# EAGLE design OUT_7SEG (EAGLE 9.6.2)
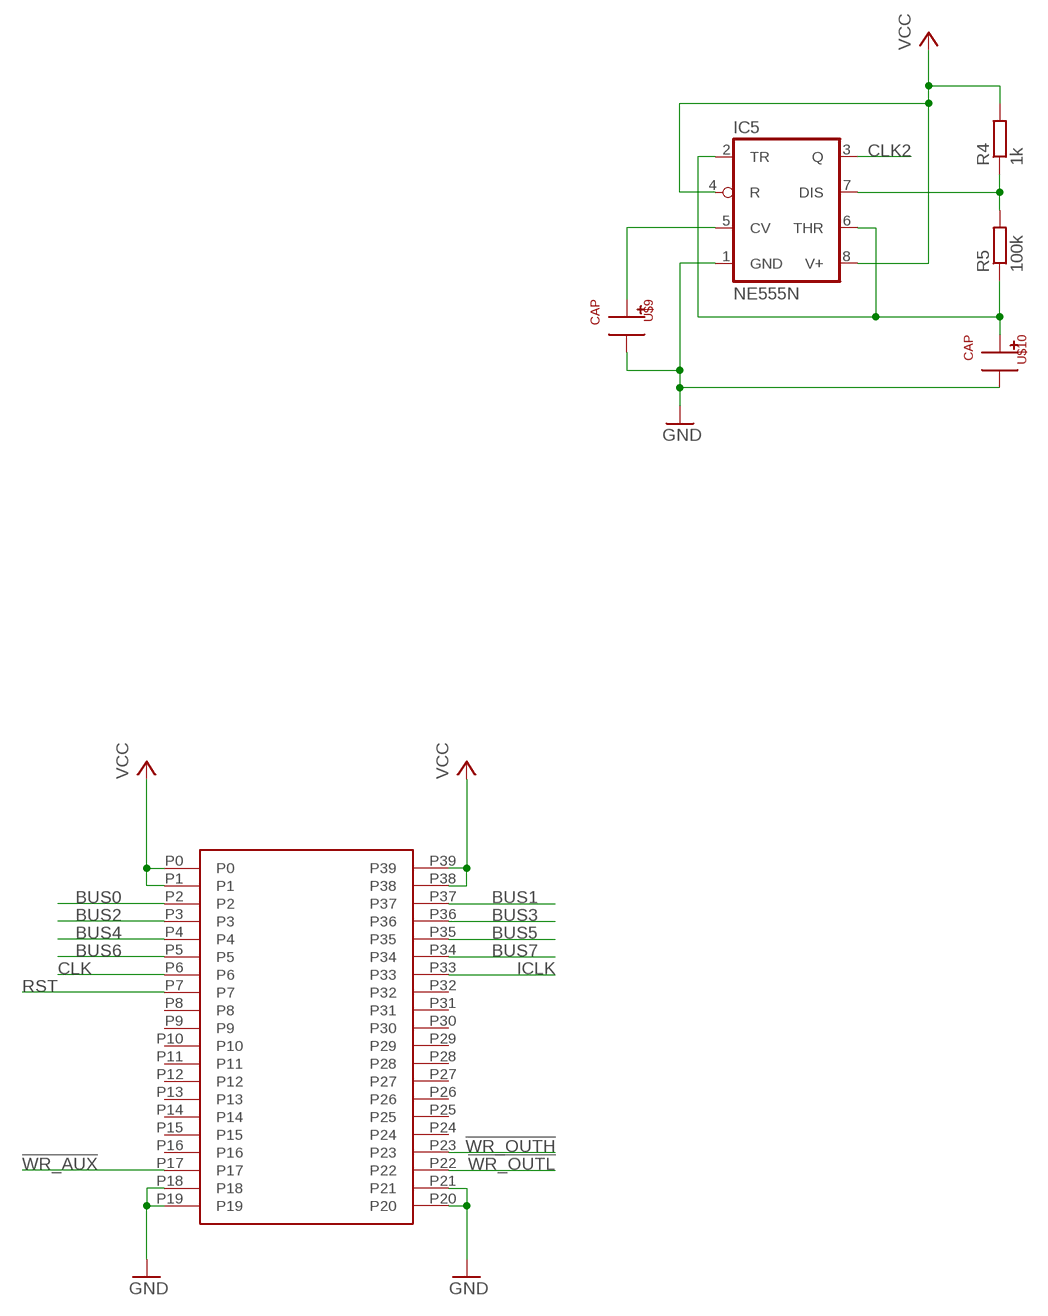
[diagram p0: schematic, sheet 1, part 1 of 2]
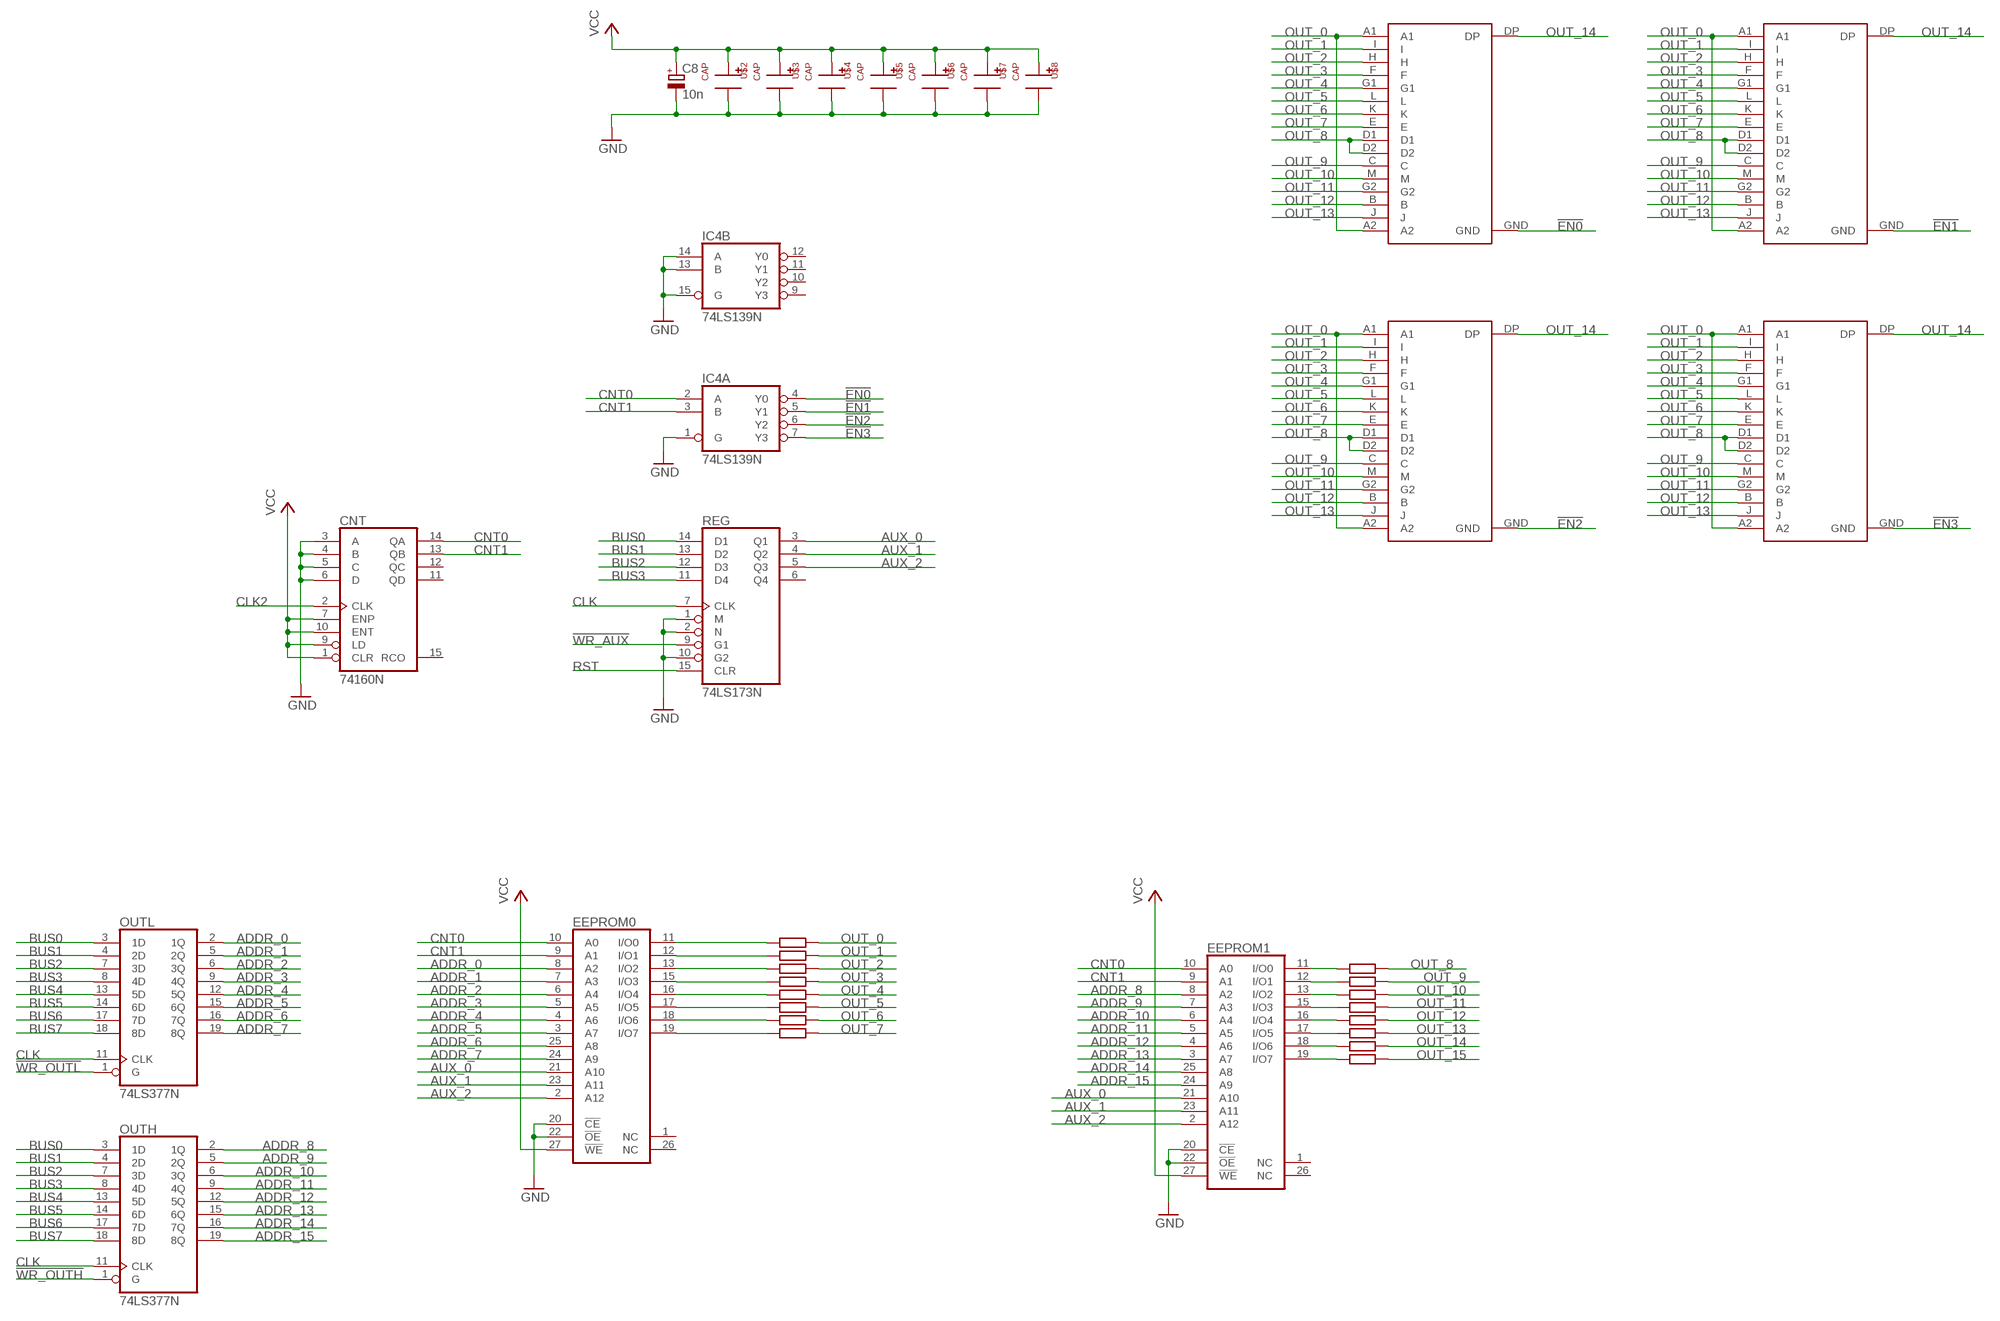
[diagram p1: schematic, sheet 1, part 2 of 2]

## Parts
C8  10n  CPOL-EUE2,5-6E  [E2,5-6E]
CNT  74160N  [DIL16]
DISP1  16SEG  [16SEG]
DISP2  16SEG  [16SEG]
DISP3  16SEG  [16SEG]
DISP4  16SEG  [16SEG]
EEPROM0  78C64P  [DIL28-6]
EEPROM1  78C64P  [DIL28-6]
IC4  74LS139N  [DIL16]
IC5  NE555N  [DIL08]
OUTH  74LS377N  [DIL20]
OUTL  74LS377N  [DIL20]
R1  330  R-EU_R0805  [R0805]
R2  330  R-EU_R0805  [R0805]
R3  330  R-EU_R0805  [R0805]
R4  1k  R-EU_0204/7  [0204/7]
R5  100k  R-EU_0204/7  [0204/7]
R6  330  R-EU_R0805  [R0805]
R7  330  R-EU_R0805  [R0805]
R8  330  R-EU_R0805  [R0805]
R9  330  R-EU_R0805  [R0805]
R10  330  R-EU_R0805  [R0805]
R11  330  R-EU_R0805  [R0805]
R12  330  R-EU_R0805  [R0805]
R13  330  R-EU_R0805  [R0805]
R14  330  R-EU_R0805  [R0805]
R15  330  R-EU_R0805  [R0805]
R16  330  R-EU_R0805  [R0805]
R17  330  R-EU_R0805  [R0805]
R41  330  R-EU_R0805  [R0805]
REG  74LS173N  [DIL16]
U$1  2X40  [2X40]
U$2  CAP  [CAP]
U$3  CAP  [CAP]
U$4  CAP  [CAP]
U$5  CAP  [CAP]
U$6  CAP  [CAP]
U$7  CAP  [CAP]
U$8  CAP  [CAP]
U$9  CAP  [CAP]
U$10  CAP  [CAP]

## Nets
!EN0: DISP1.GND IC4.4(A:Y0)
!EN1: DISP2.GND IC4.5(A:Y1)
!EN2: DISP3.GND IC4.6(A:Y2)
!EN3: DISP4.GND IC4.7(A:Y3)
!WR_AUX: REG.9(G1) U$1.P17
!WR_OUTH: OUTH.1(G) U$1.P23
!WR_OUTL: OUTL.1(G) U$1.P22
ADDR_0: EEPROM0.8(A2) OUTL.2(1Q)
ADDR_1: EEPROM0.7(A3) OUTL.5(2Q)
ADDR_2: EEPROM0.6(A4) OUTL.6(3Q)
ADDR_3: EEPROM0.5(A5) OUTL.9(4Q)
ADDR_4: EEPROM0.4(A6) OUTL.12(5Q)
ADDR_5: EEPROM0.3(A7) OUTL.15(6Q)
ADDR_6: EEPROM0.25(A8) OUTL.16(7Q)
ADDR_7: EEPROM0.24(A9) OUTL.19(8Q)
ADDR_8: EEPROM1.8(A2) OUTH.2(1Q)
ADDR_9: EEPROM1.7(A3) OUTH.5(2Q)
ADDR_10: EEPROM1.6(A4) OUTH.6(3Q)
ADDR_11: EEPROM1.5(A5) OUTH.9(4Q)
ADDR_12: EEPROM1.4(A6) OUTH.12(5Q)
ADDR_13: EEPROM1.3(A7) OUTH.15(6Q)
ADDR_14: EEPROM1.25(A8) OUTH.16(7Q)
ADDR_15: EEPROM1.24(A9) OUTH.19(8Q)
AUX_0: EEPROM0.21(A10) EEPROM1.21(A10) REG.3(Q1)
AUX_1: EEPROM0.23(A11) EEPROM1.23(A11) REG.4(Q2)
AUX_2: EEPROM0.2(A12) EEPROM1.2(A12) REG.5(Q3)
BUS0: OUTH.3(1D) OUTL.3(1D) REG.14(D1) U$1.P2
BUS1: OUTH.4(2D) OUTL.4(2D) REG.13(D2) U$1.P37
BUS2: OUTH.7(3D) OUTL.7(3D) REG.12(D3) U$1.P3
BUS3: OUTH.8(4D) OUTL.8(4D) REG.11(D4) U$1.P36
BUS4: OUTH.13(5D) OUTL.13(5D) U$1.P4
BUS5: OUTH.14(6D) OUTL.14(6D) U$1.P35
BUS6: OUTH.17(7D) OUTL.17(7D) U$1.P5
BUS7: OUTH.18(8D) OUTL.18(8D) U$1.P34
CLK: OUTH.11(CLK) OUTL.11(CLK) REG.7(CLK) U$1.P6
CLK2: CNT.2(CLK) IC5.3(Q)
CNT0: CNT.14(QA) EEPROM0.10(A0) EEPROM1.10(A0) IC4.2(A:A)
CNT1: CNT.13(QB) EEPROM0.9(A1) EEPROM1.9(A1) IC4.3(A:B)
GND [supply]: C8.- CNT.3(A) CNT.4(B) CNT.5(C) CNT.6(D) EEPROM0.20(!CE) EEPROM0.22(!OE) EEPROM1.20(!CE) EEPROM1.22(!OE) IC4.1(A:G) IC4.13(B:B) IC4.14(B:A) IC4.15(B:G) IC5.1(GND) REG.1(M) REG.2(N) REG.10(G2) U$1.P18 U$1.P19 U$1.P20 U$1.P21 U$2.P- U$3.P- U$4.P- U$5.P- U$6.P- U$7.P- U$8.P- U$9.P- U$10.P-
ICLK: U$1.P33
N$1: IC5.7(DIS) R4.1 R5.2
N$2: IC5.5(CV) U$9.P+
N$3: EEPROM1.11(I/O0) R41.1
N$4: EEPROM1.12(I/O1) R1.1
N$5: EEPROM1.13(I/O2) R2.1
N$6: EEPROM1.15(I/O3) R3.1
N$7: EEPROM1.16(I/O4) R6.1
N$8: EEPROM1.17(I/O5) R7.1
N$9: EEPROM1.18(I/O6) R8.1
N$10: EEPROM1.19(I/O7) R9.1
N$11: EEPROM0.11(I/O0) R10.1
N$12: EEPROM0.12(I/O1) R11.1
N$13: EEPROM0.13(I/O2) R12.1
N$14: EEPROM0.15(I/O3) R13.1
N$15: EEPROM0.16(I/O4) R14.1
N$16: EEPROM0.17(I/O5) R16.1
N$17: EEPROM0.18(I/O6) R15.1
N$18: EEPROM0.19(I/O7) R17.1
N$36: IC5.2(TR) IC5.6(THR) R5.1 U$10.P+
OUT_0: DISP1.A1 DISP1.A2 DISP2.A1 DISP2.A2 DISP3.A1 DISP3.A2 DISP4.A1 DISP4.A2 R10.2
OUT_1: DISP1.I DISP2.I DISP3.I DISP4.I R11.2
OUT_2: DISP1.H DISP2.H DISP3.H DISP4.H R12.2
OUT_3: DISP1.F DISP2.F DISP3.F DISP4.F R13.2
OUT_4: DISP1.G1 DISP2.G1 DISP3.G1 DISP4.G1 R14.2
OUT_5: DISP1.L DISP2.L DISP3.L DISP4.L R16.2
OUT_6: DISP1.K DISP2.K DISP3.K DISP4.K R15.2
OUT_7: DISP1.E DISP2.E DISP3.E DISP4.E R17.2
OUT_8: DISP1.D1 DISP1.D2 DISP2.D1 DISP2.D2 DISP3.D1 DISP3.D2 DISP4.D1 DISP4.D2 R41.2
OUT_9: DISP1.C DISP2.C DISP3.C DISP4.C R1.2
OUT_10: DISP1.M DISP2.M DISP3.M DISP4.M R2.2
OUT_11: DISP1.G2 DISP2.G2 DISP3.G2 DISP4.G2 R3.2
OUT_12: DISP1.B DISP2.B DISP3.B DISP4.B R6.2
OUT_13: DISP1.J DISP2.J DISP3.J DISP4.J R7.2
OUT_14: DISP1.DP DISP2.DP DISP3.DP DISP4.DP R8.2
OUT_15: R9.2
RST: REG.15(CLR) U$1.P7
VCC [supply]: C8.+ CNT.1(CLR) CNT.7(ENP) CNT.9(LD) CNT.10(ENT) EEPROM0.27(!WE) EEPROM1.27(!WE) IC5.4(R) IC5.8(V+) R4.2 U$1.P0 U$1.P1 U$1.P38 U$1.P39 U$2.P+ U$3.P+ U$4.P+ U$5.P+ U$6.P+ U$7.P+ U$8.P+
Unconnected: CNT.11(QD) CNT.12(QC) CNT.15(RCO) EEPROM0.1(NC) EEPROM0.26(NC) EEPROM1.1(NC) EEPROM1.26(NC) IC4.9(B:Y3) IC4.10(B:Y2) IC4.11(B:Y1) IC4.12(B:Y0) REG.6(Q4) U$1.P8 U$1.P9 U$1.P10 U$1.P11 U$1.P12 U$1.P13 U$1.P14 U$1.P15 U$1.P16 U$1.P24 U$1.P25 U$1.P26 U$1.P27 U$1.P28 U$1.P29 U$1.P30 U$1.P31 U$1.P32

## Power pins joined to a net without a drawn wire
GND: CNT.8(GND) EEPROM0.14(GND) EEPROM1.14(GND) IC4.8(P:GND) OUTH.10(GND) OUTL.10(GND) REG.8(GND)
VCC: CNT.16(VCC) EEPROM0.28(VCC) EEPROM1.28(VCC) IC4.16(P:VCC) OUTH.20(VCC) OUTL.20(VCC) REG.16(VCC)

## Library data of the parts
C8 = rcl:CPOL-EU: POLARIZED CAPACITOR, European symbol; SPICEPREFIX: C
CNT = 74xx-eu:74*160: Synchronous 4-bit COUNTER
DISP1-DISP4 = IsaacAlonso:16SEG
EEPROM0 EEPROM1 = memory-idt:78C64P: MEMORY; OC_FARNELL: unknown; OC_NEWARK: unknown
IC4 = 74xx-eu:74*139: Dual 2-line to 4-line DECODER/DEMULTIPLEXER
IC5 = linear:*555: TIMER
OUTH OUTL = 74xx-eu:74*377: Octal D type FLIP FLOP, enable
R1-R17 R41 = rcl:R-EU_: RESISTOR, European symbol; SPICEPREFIX: R
REG = 74xx-eu:74*173: 4-bit D type REGISTER, 3-state
U$1 = IsaacAlonso:2X40
U$2-U$10 = IsaacAlonso:CAP

## Net classes
1 supply: width 0.508 mm

## Board
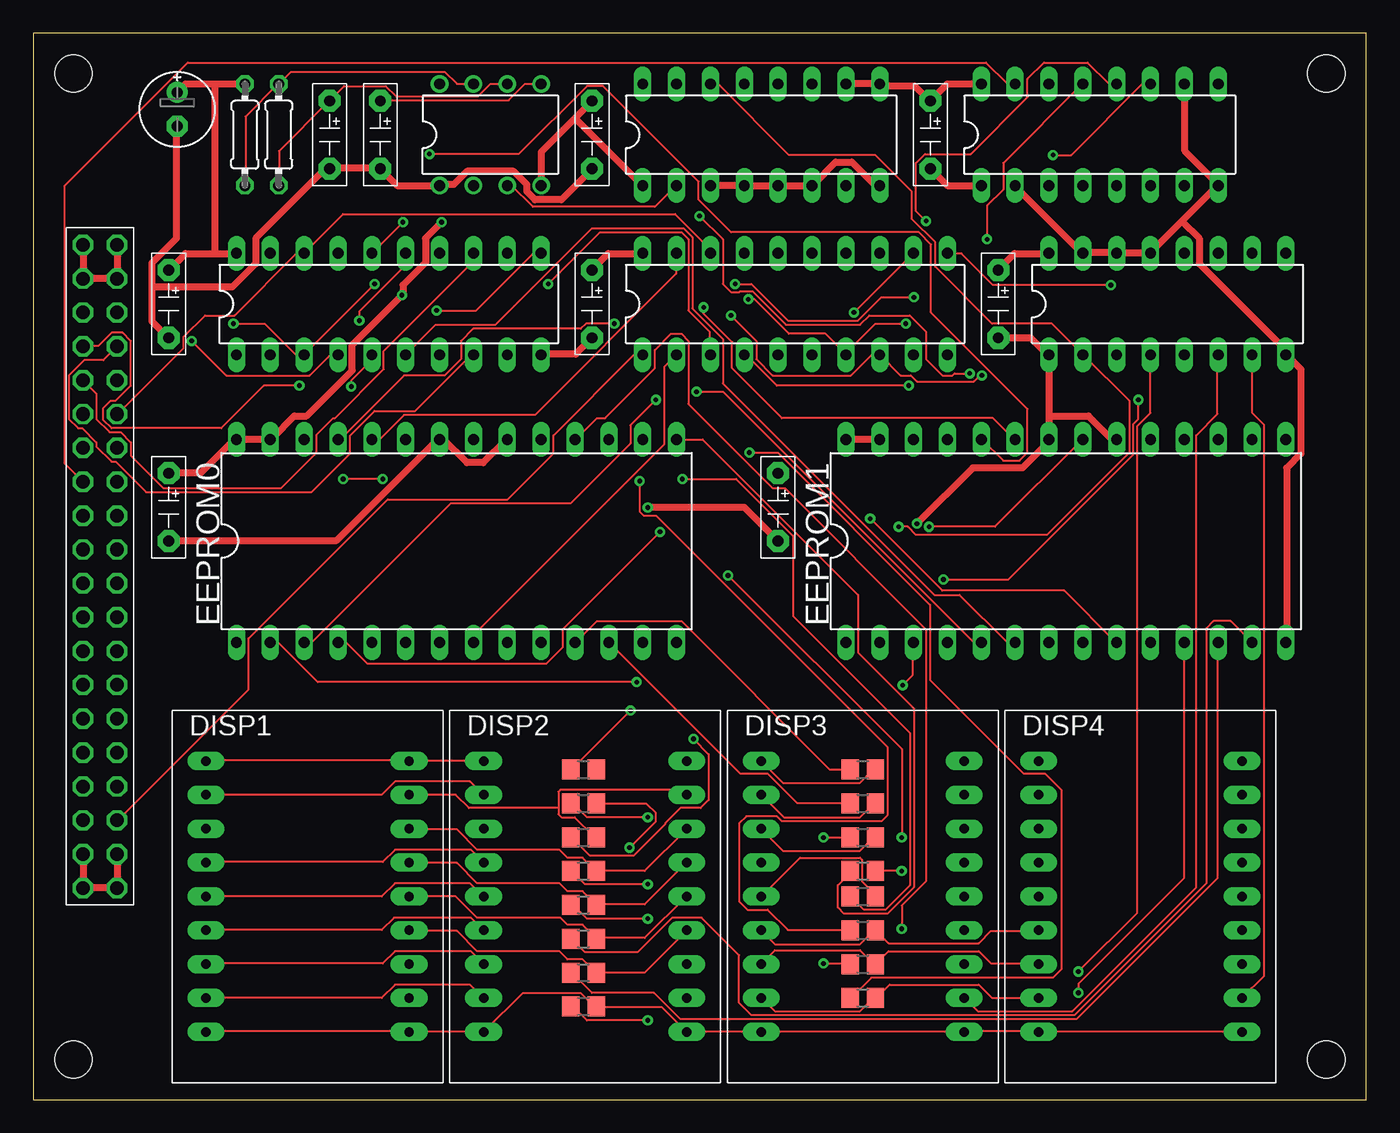
[diagram p2: board, top side]
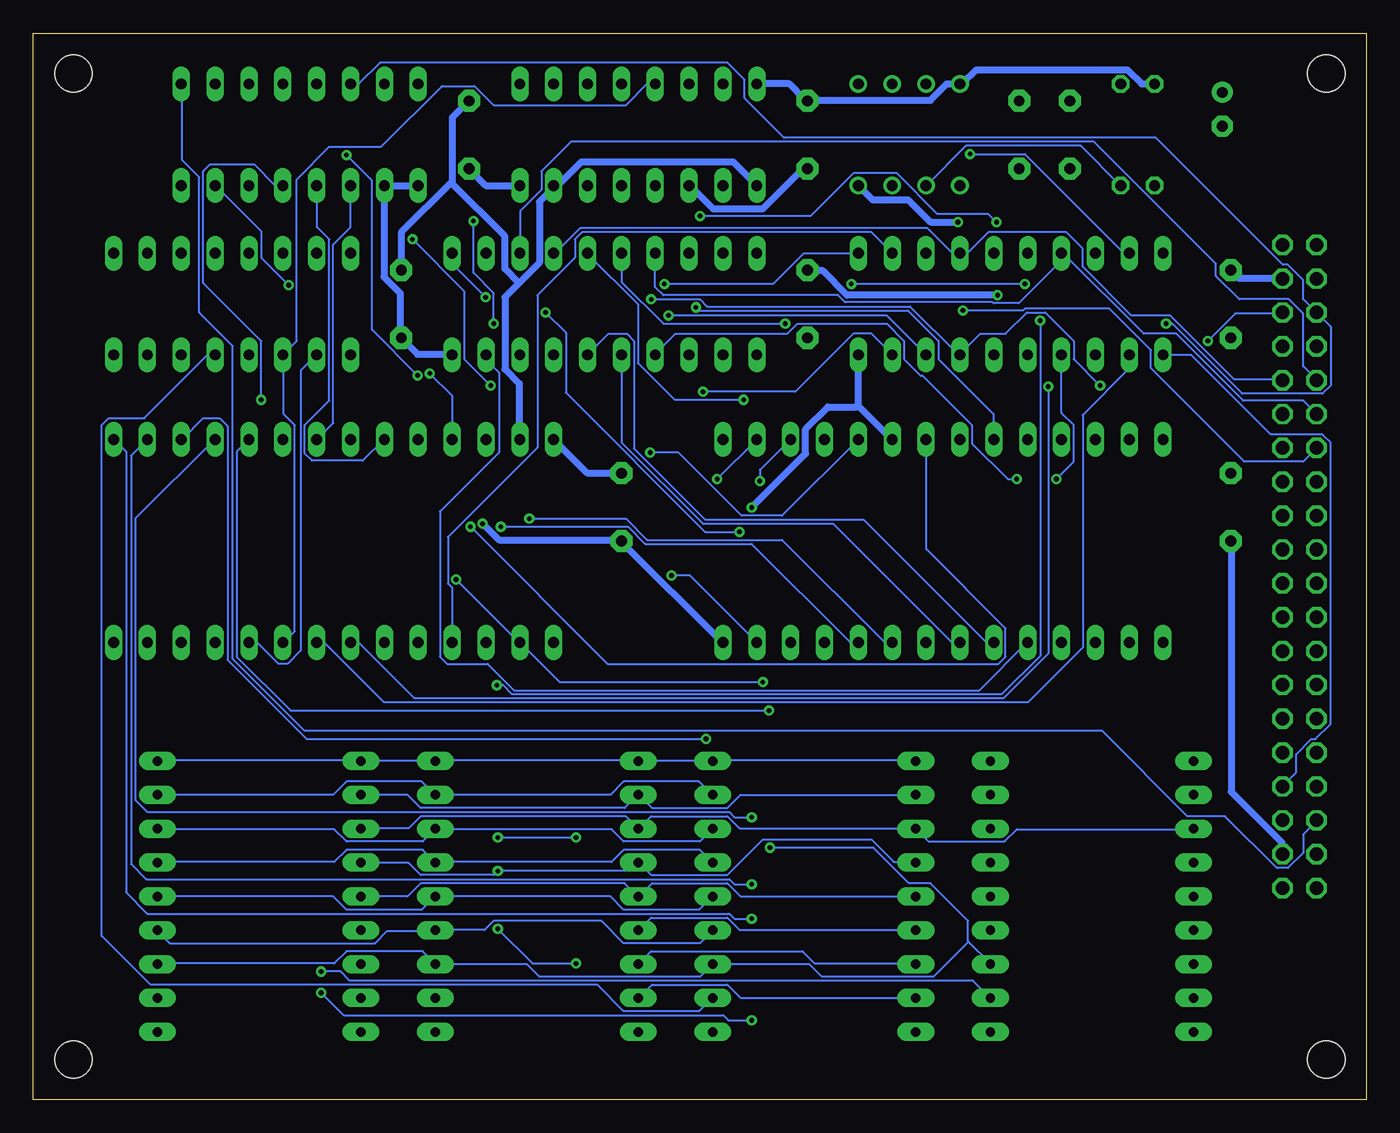
[diagram p3: board, bottom side, seen from below]

Size 100 x 80 mm. Coordinates in mm from the lower left corner, seen from the top.
Outline: 0,0 100,0 100,80 0,80 0,0
Copper layers (1*16): Top 0.035mm / dielectric 1.5mm / Bottom 0.035mm
Design rules "default": minimum track width 6mil, minimum drill 0.35mm, track to track 6mil, track to pad 6mil, pad to pad 6mil, via to via 6mil, smd to smd 6mil, copper to edge 40mil, drill to drill 6mil, minimum pad ring 10mil, minimum via ring 8mil, stop-mask expansion 4mil, vias tented up to drill 0mil, thermal gap 10mil
Holes 2.8 mm at 3,77 3,3 97,3 97,77
vRestrict: area 59.2,47 to 95.8,52.1; area 59.2,31.8 to 95.8,36.8; area 13.5,31.8 to 50,36.8; area 13.5,47 to 50,52.1; area 14,61.6 to 39.4,65.4; area 14,54 to 39.4,57.8; area 44.5,61.6 to 67.3,65.4; area 44.5,54 to 69.8,57.8; area 74.9,61.6 to 95.2,65.4; area 74.9,54 to 95.2,57.8; area 69.8,66.7 to 90.2,70.5; area 69.8,74.3 to 90.2,78.1; 9 more areas

### Footprints (pad centres in the part's own frame; a part is rotated, then mirrored left to right if it is on the bottom)
E2,5-6E = drill 0.813 pad 1.575: + -1.27,0 | drill 0.813 pad 1.575 octagon: - 1.27,0
DIL16 = drill 0.813 long: 1 -8.89,-3.81; 2 -6.35,-3.81; 3 -3.81,-3.81; 4 -1.27,-3.81; 5 1.27,-3.81; 6 3.81,-3.81; 7 6.35,-3.81; 8 8.89,-3.81; 9 8.89,3.81; 10 6.35,3.81; 11 3.81,3.81; 12 1.27,3.81; 13 -1.27,3.81; 14 -3.81,3.81; 15 -6.35,3.81; 16 -8.89,3.81
16SEG = drill 0.711 pad 1.397 long: A1 -7.62,10.16; A2 7.62,10.16; B 7.62,5.08; C 7.62,-2.54; D1 -7.62,-10.16; D2 7.62,-10.16; DP 7.62,-5.08; E -7.62,-7.62; F -7.62,2.54; G1 -7.62,0; G2 7.62,2.54; GND 7.62,-7.62; H -7.62,5.08; I -7.62,7.62; J 7.62,7.62; K -7.62,-5.08; L -7.62,-2.54; M 7.62,0
DIL28-6 = drill 0.813 long: 1 -16.51,-7.62; 2 -13.97,-7.62; 3 -11.43,-7.62; 4 -8.89,-7.62; 5 -6.35,-7.62; 6 -3.81,-7.62; 7 -1.27,-7.62; 8 1.27,-7.62; 9 3.81,-7.62; 10 6.35,-7.62; 11 8.89,-7.62; 12 11.43,-7.62; 13 13.97,-7.62; 14 16.51,-7.62; 15 16.51,7.62; 16 13.97,7.62; 17 11.43,7.62; 18 8.89,7.62; 19 6.35,7.62; 20 3.81,7.62; 21 1.27,7.62; 22 -1.27,7.62; 23 -3.81,7.62; 24 -6.35,7.62; 25 -8.89,7.62; 26 -11.43,7.62; 27 -13.97,7.62; 28 -16.51,7.62
DIL08 = drill 0.813 pad 1.27: 1 -3.81,-3.81; 2 -1.27,-3.81; 3 1.27,-3.81; 4 3.81,-3.81; 5 3.81,3.81; 6 1.27,3.81; 7 -1.27,3.81; 8 -3.81,3.81
DIL20 = drill 0.813 long: 1 -11.43,-3.81; 2 -8.89,-3.81; 3 -6.35,-3.81; 4 -3.81,-3.81; 5 -1.27,-3.81; 6 1.27,-3.81; 7 3.81,-3.81; 8 6.35,-3.81; 9 8.89,-3.81; 10 11.43,-3.81; 11 11.43,3.81; 12 8.89,3.81; 13 6.35,3.81; 14 3.81,3.81; 15 1.27,3.81; 16 -1.27,3.81; 17 -3.81,3.81; 18 -6.35,3.81; 19 -8.89,3.81; 20 -11.43,3.81
R0805 = smd 1.3 x 1.5: 1 -0.95,0; 2 0.95,0
0204/7 = drill 0.813 octagon: 1 -3.81,0; 2 3.81,0
2X40 = drill 1.016 octagon: P0 -1.27,24.13; P1 -1.27,21.59; P2 -1.27,19.05; P3 -1.27,16.51; P4 -1.27,13.97; P5 -1.27,11.43; P6 -1.27,8.89; P7 -1.27,6.35; P8 -1.27,3.81; P9 -1.27,1.27; P10 -1.27,-1.27; P11 -1.27,-3.81; P12 -1.27,-6.35; P13 -1.27,-8.89; P14 -1.27,-11.43; P15 -1.27,-13.97; P16 -1.27,-16.51; P17 -1.27,-19.05; P18 -1.27,-21.59; P19 -1.27,-24.13; P20 1.27,-24.13; P21 1.27,-21.59; P22 1.27,-19.05; P23 1.27,-16.51; P24 1.27,-13.97; P25 1.27,-11.43; P26 1.27,-8.89; P27 1.27,-6.35; P28 1.27,-3.81; P29 1.27,-1.27; P30 1.27,1.27; P31 1.27,3.81; P32 1.27,6.35; P33 1.27,8.89; P34 1.27,11.43; P35 1.27,13.97; P36 1.27,16.51; P37 1.27,19.05; P38 1.27,21.59; P39 1.27,24.13
CAP = drill 0.813 pad 1.651 octagon: P+ 0,2.54; P- 0,-2.54

### Placement (x,y rotation side)
C8  10.79,74.3 270 top
CNT  54.61,72.39 0 top
DISP1  20.57,15.24 0 top
DISP2  41.4,15.24 0 top
DISP3  62.23,15.24 0 top
DISP4  83.06,15.24 0 top
EEPROM0  31.75,41.91 0 top
EEPROM1  77.47,41.91 0 top
IC4  85.09,59.69 0 top
IC5  34.29,72.39 0 top
OUTH  26.67,59.69 0 top
OUTL  57.15,59.69 0 top
R1  41.27,9.53 0 top
R2  41.27,12.06 0 top
R3  41.27,14.61 0 top
R4  15.88,72.39 90 top
R5  18.41,72.39 90 top
R6  41.27,17.14 0 top
R7  41.27,19.68 0 top
R8  41.27,22.23 0 top
R9  41.27,24.77 0 top
R10  62.23,24.77 0 top
R11  62.23,22.23 0 top
R12  62.23,19.68 0 top
R13  62.23,17.14 0 top
R14  62.23,15.24 0 top
R15  62.23,10.16 0 top
R16  62.23,12.7 0 top
R17  62.23,7.62 0 top
R41  41.27,6.99 0 top
REG  80.01,72.39 0 top
U$1  5,40 0 top
U$2  72.39,59.69 0 top
U$3  41.91,59.69 0 top
U$4  55.88,44.45 0 top
U$5  10.16,59.69 0 top
U$6  10.16,44.45 0 top
U$7  41.91,72.39 0 top
U$8  67.31,72.39 0 top
U$9  26.04,72.39 0 top
U$10  22.23,72.39 0 top

### Tracks (layer width: path | path; a pad name or v marks a point on that pad's centre or on a via)
!EN0  (via drill 0.35)
  Top 0.152: IC4.4 83.82,51.51 82.83,50.52 82.83,14.02 v78.41,9.6
  Bottom 0.152: v78.41,9.6 76.96,9.6 76.28,8.91 29.49,8.91 DISP1.GND
!EN1
  Bottom 0.152: IC4.5 86.41,55.85 86.94,55.85 91.67,51.13 94.34,51.13 94.87,50.6 94.87,12.27 91.21,8.61 57.68,8.61 55.7,6.63 50.06,6.63 49.07,7.62 DISP2.GND
!EN2
  Top 0.152: IC4.6 88.85,55.85 88.85,51.44 87.25,49.84 87.25,15.93 77.95,6.63 70.87,6.63 69.88,7.62 DISP3.GND
!EN3
  Top 0.152: IC4.7 91.44,51.51 92.35,50.6 92.35,9.3 DISP4.GND
!WR_AUX
  Bottom 0.152: REG.9 88.85,76.2 88.85,70.48 87.55,69.19 87.55,59.05 85.04,56.54 85.04,33.07 79.63,27.66 19.81,27.66 13.41,21.26 10.59,21.26 6.71,17.37 5.87,17.37 4.72,18.52 4.72,19.89 3.73,20.88 U$1.P17
!WR_OUTH
  Bottom 0.152: OUTH.1 15.24,55.85 13.11,55.85 7.16,49.91 3.28,49.91 2.67,49.3 2.67,28.19 3.81,27.05 4.12,27.05 5.26,25.91 5.26,24.54 6.25,23.55 U$1.P23
!WR_OUTL
  Top 0.152: OUTL.1 45.72,55.85 45.03,55.85 39.01,49.84 39.01,48.46 35.59,45.03 26.59,45.03 16.15,34.59 16.15,30.79 6.33,20.95 U$1.P22
ADDR_0
  Top 0.152: OUTL.2 47.32,54.94 47.32,49.15 33.07,34.9 33.07,34.29 EEPROM0.8
ADDR_1
  Bottom 0.152: EEPROM0.7 31.09,34.29 40.01,43.2 49.76,43.2 55.85,49.3 55.85,55.85 OUTL.5
ADDR_2
  Bottom 0.152: EEPROM0.6 28.5,34.29 37.72,43.51 49.61,43.51 54.94,48.84 54.94,56.92 55.47,57.45 56.84,57.45 OUTL.6
ADDR_3
  Bottom 0.152: EEPROM0.5 25.45,34.29 29.03,30.71 63.93,30.71 65.91,32.69 68.96,32.69 69.49,33.22 69.49,44.12 65.08,48.54 65.08,54.56 65.99,55.47 65.99,55.85 OUTL.9
ADDR_4  (via drill 0.35)
  Top 0.152: EEPROM0.4 23.47,34.29 25.07,32.69 38.48,32.69 39.7,33.91 39.7,35.28 v47.02,42.6 | v61.57,59.05 65.99,63.48 OUTL.12
  Bottom 0.152: v47.02,42.6 49.61,42.6 60.05,53.03 60.05,57.53 v61.57,59.05
ADDR_5  (via drill 0.35)
  Top 0.152: EEPROM0.3 20.88,34.29 31.32,44.73 40.31,44.73 44.81,49.23 44.81,50.6 v46.71,52.5
  Bottom 0.152: v46.71,52.5 51.89,52.5 54.63,55.24 54.63,59.66 58.45,63.48 OUTL.15
ADDR_6  (via drill 0.35)
  Top 0.152: EEPROM0.25 23.01,49.53 27.81,54.33 30.86,54.33 32.08,55.55 32.08,56.92 32.99,57.84 41.07,57.84 41.45,58.22 v43.59,58.22
  Bottom 0.152: v43.59,58.22 52.73,58.22 55.85,61.34 55.85,63.48 OUTL.16
ADDR_7
  Top 0.152: EEPROM0.24 25.98,49.53 27.81,51.36 37.64,51.36 48.23,61.95 48.23,63.48 OUTL.19
ADDR_8
  Bottom 0.152: EEPROM1.8 78.18,34.29 73.69,29.79 25.38,29.79 21.26,33.91 21.26,51.36 17.83,54.79 17.83,55.85 OUTH.2
ADDR_9  (via drill 0.35)
  Top 0.152: v23.85,53.49 23.85,53.95 25.38,55.47 25.38,55.85 OUTH.5
  Bottom 0.152: EEPROM1.7 75.59,34.29 71.4,30.1 27.2,30.1 23.85,33.45 v23.85,53.49
ADDR_10
  Top 0.152: EEPROM1.6 73.08,34.29 69.49,37.87 67.59,37.87 51.74,53.72 51.74,57.07 49.45,59.36 49.45,64.69 48.77,65.38 41.91,65.38 34.67,58.14 30.18,58.14 27.96,55.93 OUTH.6
ADDR_11  (via drill 0.35)
  Top 0.152: EEPROM1.5 70.56,34.29 51.74,53.11 v49.76,53.11
  Bottom 0.152: v49.76,53.11 42.82,53.11 38.48,57.45 37.11,57.45 35.59,55.93 OUTH.9
ADDR_12
  Bottom 0.152: EEPROM1.4 68.58,38.41 68.89,38.71 68.89,42.22 62.18,48.92 62.18,60.35 59.36,63.17 59.36,64.54 58.83,65.08 37.11,65.08 35.59,63.55 OUTH.12
ADDR_13  (via drill 0.35)
  Top 0.152: v65.23,31.09 65.99,31.85 65.99,34.29 EEPROM1.3 | v24.46,58.45 24.46,59.13 27.89,62.56 27.89,63.48 OUTH.15
  Bottom 0.152: v65.23,31.09 64.77,31.09 64.08,30.4 27.36,30.4 24.46,33.3 v24.46,58.45
ADDR_14  (via drill 0.35)
  Top 0.152: v70.26,54.48 69.11,54.48 68.96,54.33 68.2,54.33 66.98,55.55 66.98,57.61 65.76,58.83 62.71,58.83 62.03,58.14 56.46,58.14 53.95,60.66 53.03,60.66 52.96,60.58 52.35,60.58 51.74,61.19 51.74,64.54 v49.99,66.29 | OUTH.16 v27.74,65.84
  Bottom 0.152: EEPROM1.25 68.58,52.81 v70.26,54.48 | v49.99,66.29 41.68,66.29 38.48,69.49 35.2,69.49 32.16,66.45 28.35,66.45 v27.74,65.84
ADDR_15  (via drill 0.35)
  Top 0.152: v29.72,70.94 36.42,70.94 41.53,76.05 42.75,76.05 49.91,68.89 49.91,67.51 52.35,65.08 66.45,65.08 67.36,64.16 67.36,59.05 74.6,51.82 74.6,48.54 73.99,47.93 72.77,47.93 71.17,49.53 EEPROM1.24
  Bottom 0.152: v29.72,70.94 25.6,70.94 18.21,63.55 17.83,63.55 OUTH.19
AUX_0  (via drill 0.35)
  Top 0.152: v67.21,42.98 72.16,42.98 78.72,49.53 EEPROM1.21
  Bottom 0.152: v67.21,42.98 56.92,32.69 27.58,32.69 27.05,33.22 27.05,35.36 32.99,41.3 32.99,49.53 EEPROM0.21 | REG.3 76.2,65.46 77.5,64.16 77.5,50.75 78.72,49.53 EEPROM1.21
AUX_1  (via drill 0.35)
  Top 0.152: v50.29,59.44 50.29,58.98 52.43,56.84 52.43,54.86 56.16,51.13 72.01,51.13 73.61,49.53 EEPROM1.23
  Bottom 0.152: v50.29,59.44 50.06,59.21 34.37,59.21 32.08,56.92 32.08,55.55 27.96,51.44 27.96,49.53 EEPROM0.23 | REG.4 78.72,68.58 78.72,65.46 77.8,64.54 77.8,52.43 79.63,50.6 79.63,48.46 79.1,47.93 75.29,47.93 73.69,49.53 EEPROM1.23
AUX_2  (via drill 0.35)
  Top 0.152: EEPROM0.2 18.36,34.29 21.34,31.32 v45.26,31.32 | v82.91,52.5 82.91,51.05 82.53,50.67 82.53,48.39 73.15,39.01 v68.28,39.01
  Bottom 0.152: v45.26,31.32 60.5,31.32 63.48,34.29 EEPROM1.2 63.55,34.29 v68.28,39.01 | REG.5 81.84,68.58 83.44,70.18 86.72,70.18 87.25,69.65 87.25,61.27 82.91,56.92 v82.91,52.5
BUS0  (via drill 0.35)
  Top 0.152: v15.01,58.22 17.37,58.22 19.66,55.93 20.27,55.93 OUTH.3 20.34,55.93 v25.6,61.19 | v38.63,61.19 42.52,65.08 48.62,65.08 49.15,64.54 49.15,59.21 50.75,57.61 50.75,55.93 OUTL.3
  Bottom 0.152: v15.01,58.22 14.55,58.22 9.3,52.96 3.28,52.96 2.67,53.57 2.67,57.99 3.66,58.98 U$1.P2 4.72,60.05 4.72,61.49 5.87,62.64 6.25,62.64 15.77,72.16 43.66,72.16 46.63,75.13 46.63,76.5 47.93,77.8 73.99,77.8 75.59,76.2 REG.14 | v25.6,61.19 v38.63,61.19
BUS1  (via drill 0.35)
  Top 0.152: v11.89,56.92 14.48,54.33 20.73,54.33 22.25,55.85 22.86,55.85 OUTH.4 | v65.68,53.57 55.78,53.57 53.49,55.85 53.34,55.85 OUTL.4 | v71.55,64.54 71.55,67.06 72.77,68.28 72.77,70.26 78.72,76.2 REG.13 | v26.21,46.56 v23.24,46.56
  Bottom 0.152: v11.89,56.92 9.83,58.98 6.33,58.98 U$1.P37 | v65.68,53.57 67.67,55.55 67.67,60.66 v71.55,64.54 | OUTH.4 22.86,51.51 21.95,50.6 21.95,47.85 v23.24,46.56 | v26.21,46.56 26.9,46.56 29.57,49.23 29.57,50.6 33.3,54.33 33.45,54.33 34.67,55.55 34.67,56.92 35.97,58.22 42.67,58.22 43.43,57.45 51.82,57.45 53.34,55.93 OUTL.4
BUS2  (via drill 0.35)
  Top 0.152: v53.65,60.05 54.1,60.05 56.69,57.45 59.44,57.45 60.96,55.93 OUTL.7 60.96,56.01 63.17,58.22 v65.46,58.22 | REG.12 80.7,76.2 79.1,77.8 75.82,77.8 74.6,76.58 74.6,75.21 70.33,70.94 66.9,70.94 66.22,70.26 66.22,66.67 v66.98,65.91 | v19.96,53.57 17.3,53.57 14.1,50.37 5.87,50.37 5.26,50.98 5.26,51.89 5.79,52.43 6.17,52.43 7.32,53.57 7.32,56.92 6.71,57.53 5.87,57.53 4.88,56.54 3.73,56.54 U$1.P3
  Bottom 0.152: 30.48,55.93 30.63,55.93 34.21,59.51 49.45,59.51 49.99,60.05 v53.65,60.05 | v66.98,65.91 66.98,62.03 65.46,60.5 v65.46,58.22 | v19.96,53.57 21.95,55.55 21.95,56.92 24.08,59.05 25.45,59.05 27.05,57.45 28.96,57.45 30.48,55.93 | 30.48,55.93 OUTH.7
BUS3  (via drill 0.35)
  Top 0.152: OUTH.8 32.99,55.85 32.84,55.85 28.65,51.66 25.6,51.66 23.77,49.84 23.77,48.46 20.88,45.57 8.46,45.57 6.17,47.85 5.87,47.85 4.72,49 4.72,49.3 3.66,50.37 3.35,50.37 2.67,51.05 2.67,54.33 3.81,55.47 5.26,55.47 6.25,56.46 U$1.P36 | v52.35,58.83 54.25,56.92 54.25,55.55 55.47,54.33 61.34,54.33 62.87,55.85 63.48,55.85 OUTL.8 63.55,55.85 65.08,54.33 65.84,54.33 66.29,53.87 70.56,53.87 71.02,54.33 v71.17,54.33 | REG.11 83.21,76.2 77.88,70.87 v76.5,70.87
  Bottom 0.152: v52.35,58.83 35.97,58.83 OUTH.8 | v76.5,70.87 74.6,68.96 74.6,57.76 v71.17,54.33
BUS4
  Top 0.152: OUTH.13 32.99,63.48 32.99,62.87 26.29,56.16 26.29,54.79 22.63,51.13 22.48,51.13 21.26,49.91 21.26,48.54 18.59,45.87 9.75,45.87 7.32,48.31 7.32,49.3 6.55,50.06 5.71,50.06 4.72,51.05 4.72,52.96 3.73,53.95 U$1.P4
  Bottom 0.152: OUTL.13 63.48,63.55 63.48,66.67 61.87,68.28 61.87,69.65 59.66,71.86 20.42,71.86 11.28,62.71 11.28,61.8 9.53,60.05 5.79,60.05 4.72,58.98 4.72,55.02 3.73,54.03 U$1.P4
BUS5
  Bottom 0.152: 30.48,63.55 29.87,63.55 28.35,65.08 22.48,65.08 21.26,63.86 21.26,62.48 17.6,58.83 14.71,58.83 9.91,54.03 6.33,54.03 U$1.P35 | 30.48,63.55 31.09,63.55 32.92,65.38 58.98,65.38 60.81,63.55 60.96,63.55 OUTL.14 | 30.48,63.55 OUTH.14
BUS6
  Bottom 0.152: U$1.P5 4.72,52.43 9.22,52.43 14.25,57.45 16.69,57.45 22.71,63.48 22.86,63.48 OUTH.17 22.55,63.25 26.06,59.74 27.96,59.74 28.04,59.82 39.09,59.82 39.62,60.35 52.73,60.35 53.34,60.96 OUTL.17
BUS7
  Top 0.152: U$1.P34 6.33,51.44 11.28,56.39 11.28,57.23 12.88,58.83 15.09,58.83 19.74,63.48 20.27,63.48 OUTH.18 20.34,63.55 23.24,66.45 48.16,66.45 50.75,63.86 50.75,63.55 OUTL.18
CLK  (via drill 0.35)
  Top 0.152: v80.85,61.11 72.01,61.11 69.65,63.48 68.58,63.48 OUTL.11 | v30.25,59.21 33.22,59.21 37.49,63.48 38.1,63.48 OUTH.11 | v66.06,60.2 63.63,60.2 61.87,58.45 56.62,58.45 53.87,61.19 v52.65,61.19
  Bottom 0.152: v80.85,61.11 82.91,63.17 82.91,65.15 86.33,68.58 REG.7 | v30.25,59.21 25.76,59.21 25.6,59.36 19.28,59.36 16.15,56.24 16.15,54.86 9.14,47.85 4.72,47.85 3.73,48.84 U$1.P6 | OUTL.11 68.58,62.71 v66.06,60.2 | v52.65,61.19 44.5,61.19 42.22,63.48 38.1,63.48 OUTH.11
CLK2
  Top 0.152: IC5.3 35.89,68.58 37.49,66.98 46.63,66.98 48.23,68.58 CNT.2
CNT0  (via drill 0.35)
  Top 0.152: v64.92,42.98 65.61,42.98 66.22,42.37 76.05,42.37 82.22,48.54 82.22,52.43 78.79,55.85 IC4.2 78.72,55.93 76.43,58.22 71.93,58.22 67.67,62.48 67.67,64.31 65.91,66.06 65.91,68.12 63.17,70.87 56.69,70.87 51.36,76.2 CNT.14
  Bottom 0.152: EEPROM0.10 38.71,34.29 46.1,41.68 54.1,41.68 55.4,42.98 v64.92,42.98 | EEPROM1.10 83.21,34.29 81.61,32.69 80.92,32.69 79.93,33.68 79.93,54.71 78.79,55.85 IC4.2
CNT1  (via drill 0.35)
  Top 0.152: v62.79,43.59 68.2,38.18 77.34,38.18 81.23,34.29 EEPROM1.9
  Bottom 0.152: EEPROM0.9 36.12,34.29 43.81,41.99 53.95,41.99 55.55,43.59 v62.79,43.59 | EEPROM1.9 81.23,34.29 80.39,35.13 80.39,50.6 81.23,51.44 81.23,55.85 IC4.3 80.24,56.92 80.24,69.04 77.8,71.48 73.91,71.48 69.34,76.05 66.9,76.05 65.46,74.6 55.55,74.6 53.95,76.2 CNT.13
GND  (via drill 0.35)
  Top 0.508: U$1.P18 3.73,18.36 3.73,15.93 U$1.P19 3.96,15.93 6.25,15.93 U$1.P20 6.33,16.15 6.33,18.36 U$1.P21 | U$3.P- 40.69,55.93 38.1,55.93 OUTH.10 | EEPROM0.20 35.51,49.53 33.76,47.78 32.54,47.78 30.79,49.53 EEPROM0.22 30.25,49.45 22.71,41.91 U$6.P- | EEPROM1.14 94.03,34.29 94.03,47.4 95.1,48.46 95.1,54.79 94.03,55.85 IC4.8 93.8,56.08 93.8,56.39 87.48,62.71 87.48,64.62 86.18,65.91 | 86.18,65.91 83.97,63.7 IC4.13 83.82,63.55 81.46,63.55 IC4.14 81.23,63.55 78.79,63.55 IC4.15 78.56,63.63 73.61,68.58 REG.2 | 86.18,65.91 88.85,68.58 REG.8 88.77,68.81 86.41,71.17 86.41,76.2 REG.10 | 76.2,51.28 IC4.1 75.97,56.01 74.83,57.15 U$2.P- | 76.2,51.28 EEPROM1.22 76.12,49.3 74.22,47.4 70.48,47.4 v66.29,43.2 | EEPROM1.20 80.92,49.53 79.17,51.28 76.2,51.28 | 8.91,60.96 8.91,58.37 10.13,57.15 U$5.P- | 8.91,60.96 8.91,62.79 10.74,64.62 10.74,73 C8.- | REG.1 68.58,68.58 U$8.P- | CNT.3 CNT.4 CNT.5 CNT.6 58.6,68.73 60.2,70.33 61.42,70.33 63.17,68.58 CNT.8 | U$7.P- 41.91,69.8 39.62,67.51 37.64,67.51 37.03,68.12 37.03,68.66 36.04,69.65 32.54,69.65 31.55,68.66 30.71,68.66 IC5.1 27.28,68.58 26.06,69.8 U$9.P- 25.83,69.88 22.25,69.88 U$10.P- 22.02,69.72 21.79,69.72 16.69,64.62 16.69,62.71 14.94,60.96 8.91,60.96 | v46.1,44.42 53.34,44.42 55.85,41.91 U$4.P-
  Bottom 0.508: 38.1,52.05 OUTH.10 | 38.1,52.05 35.59,49.53 EEPROM0.20 | U$1.P21 6.33,18.44 6.33,19.28 10.13,23.09 10.13,41.91 U$6.P- | EEPROM0.14 48.31,34.29 55.93,41.91 U$4.P- 56.16,41.99 65.08,41.99 v66.29,43.2 | OUTL.10 68.58,55.93 71.17,55.93 U$2.P- 72.47,57.38 72.47,60.5 73.69,61.72 73.69,68.35 REG.2 REG.1 | CNT.8 66.06,68.58 67.28,69.8 U$8.P- | U$7.P- 41.91,69.8 42.29,69.8 45.26,66.83 49,66.83 50.75,68.58 CNT.3 | v46.1,44.42 42.06,48.46 42.06,50.29 40.39,51.97 38.33,51.97 38.1,52.05
N$1
  Top 0.152: R4.1 15.93,68.58 15.93,73.76 18.36,76.2 R5.2 18.44,76.2 19.36,77.11 30.86,77.11 31.77,76.2 IC5.7
N$2
  Top 0.152: IC5.5 36.88,76.2 35.66,74.98 26.06,74.98 U$9.P+
N$3  (via drill 0.35)
  Top 0.152: v46.1,5.94 41.53,5.94 40.54,6.93 40.39,6.93 R41.1 | v78.41,8 78.41,8.69 86.33,16.61 86.33,34.29 EEPROM1.11
  Bottom 0.152: v46.1,5.94 47.85,5.94 48.23,6.33 76.73,6.33 v78.41,8
N$4
  Top 0.152: R1.1 40.39,9.53 41.91,8 46.56,8 48.54,6.02 78.26,6.02 88.85,16.61 88.85,34.29 EEPROM1.12
N$5
  Top 0.152: EEPROM1.13 89.84,35.89 88.54,35.89 88.01,35.36 88.01,16.23 78.11,6.33 53.87,6.33 52.96,7.24 52.96,10.82 50.14,13.64 47.93,13.64 45.34,11.05 41.38,11.05 40.39,12.04 R2.1
N$6  (via drill 0.35)
  Top 0.152: v46.1,13.56 41.53,13.56 40.54,14.55 40.39,14.55 R3.1
  Bottom 0.152: v46.1,13.56 47.4,13.56 47.78,13.95 91.44,13.95 93.04,15.54 93.04,48.62 93.95,49.53 EEPROM1.15
N$7  (via drill 0.35)
  Top 0.152: v46.1,16.15 41.38,16.15 40.39,17.14 R6.1
  Bottom 0.152: v46.1,16.15 47.4,16.15 47.78,16.54 91.52,16.54 92.66,17.68 92.66,48.31 EEPROM1.16
N$8  (via drill 0.35)
  Top 0.152: v49.53,27.05 50.67,25.91 50.67,22.48 50.06,21.87 48.54,21.87 47.4,20.73 47.4,20.65 45.03,18.29 41.76,18.29 40.39,19.66 R7.1
  Bottom 0.152: v49.53,27.05 79.48,27.05 85.42,32.99 85.42,50.52 86.03,51.13 87.25,51.13 88.85,49.53 EEPROM1.17
N$9  (via drill 0.35)
  Top 0.152: v46.1,21.18 41.53,21.18 40.54,22.17 40.39,22.17 R8.1
  Bottom 0.152: v46.1,21.18 47.4,21.18 47.78,21.57 91.44,21.57 92.35,22.48 92.35,43.59 86.41,49.53 EEPROM1.18
N$10  (via drill 0.35)
  Top 0.152: v44.81,29.18 40.39,24.77 R9.1
  Bottom 0.152: v44.81,29.18 80.7,29.18 84.73,33.22 84.73,48.62 EEPROM1.19
N$11
  Top 0.152: R10.1 59.74,24.77 48.62,35.89 42.29,35.89 40.69,34.29 EEPROM0.11
N$12
  Top 0.152: R11.1 61.27,22.25 57.3,22.25 55.09,24.46 53.03,24.46 43.2,34.29 EEPROM0.12
N$13  (via drill 0.35)
  Top 0.152: v59.28,19.66 61.27,19.66 R12.1 | v65.15,19.66 65.15,26.29 v52.12,39.32
  Bottom 0.152: v65.15,19.66 v59.28,19.66 | v52.12,39.32 50.75,39.32 EEPROM0.13
N$14
  Top 0.152: EEPROM0.15 50.22,49.53 61.87,37.87 61.87,33.53 66.06,29.34 66.06,15.93 64.08,13.95 60.81,13.95 60.35,14.4 60.35,16.08 61.27,16.99 61.27,17.14 R13.1
N$15  (via drill 0.35)
  Top 0.152: v48.69,46.56 52.73,46.56 57,42.29 57,36.27 65.76,27.51 65.76,16.08 63.93,14.25 62.33,14.25 61.34,15.24 R14.1
  Bottom 0.152: EEPROM0.16 v48.69,46.56
N$16  (via drill 0.35)
  Top 0.152: v45.49,46.41 45.49,44.12 45.8,43.81 46.71,43.81 64.08,26.44 64.08,21.34 63.63,20.88 56.16,20.88 55.78,21.26 53.49,21.26 52.96,20.73 52.96,14.86 53.57,14.25 55.09,14.25 56.62,12.72 61.27,12.72 R16.1
  Bottom 0.152: v45.49,46.41 45.49,47.24 43.2,49.53 EEPROM0.17
N$17  (via drill 0.35)
  Top 0.152: v59.28,10.21 61.27,10.21 R15.1 | v65.15,12.8 65.15,14.55 66.98,16.38 66.98,35.28 56.39,45.87 55.47,45.87 49.15,52.2 49.15,56.92 48.62,57.45 47.85,57.45 46.63,56.24 46.63,54.86 42.9,51.13 42.29,51.13 40.69,49.53 EEPROM0.18
  Bottom 0.152: v59.28,10.21 62.56,10.21 v65.15,12.8
N$18  (via drill 0.35)
  Top 0.152: v53.72,48.54 55.85,48.54 67.28,37.11 67.28,31.47 74.3,24.46 75.89,24.46 77.11,23.24 77.11,9.75 76.5,9.14 62.87,9.14 61.34,7.62 R17.1
  Bottom 0.152: v53.72,48.54 51.59,48.54 46.86,43.81 43.81,43.81 EEPROM0.19
N$36
  Top 0.152: R5.1 18.44,68.58 18.44,71.17 22.17,74.91 U$10.P+ 22.25,74.98 23.32,76.05 26.44,76.05 27.2,75.29 33.38,75.29 34.29,76.2 IC5.6
  Bottom 0.152: IC5.2 32.99,68.58 30.02,71.55 21.41,71.55 18.44,68.58 R5.1
OUT_0
  Top 0.152: R10.2 63.02,24.77 62.03,23.77 56.24,23.77 DISP3.A1 | 28.19,25.45 12.95,25.45 DISP1.A1 | 28.19,25.45 33.76,25.45 DISP2.A1 | 28.19,25.45 DISP1.A2
  Bottom 0.152: 75.44,25.45 69.88,25.45 DISP3.A2 69.8,25.45 54.63,25.45 DISP3.A1 54.56,25.45 49.07,25.45 DISP2.A2 49,25.45 33.83,25.45 DISP2.A1 | 75.44,25.45 90.68,25.45 DISP4.A2 | 75.44,25.45 DISP4.A1
OUT_1
  Top 0.152: DISP1.I 26.14,22.86 27.13,23.85 32.77,23.85 33.76,22.86 DISP2.I | R11.2 63.17,22.17 63.02,22.17 62.03,21.18 56.31,21.18 54.63,22.86 DISP3.I
  Bottom 0.152: DISP4.I 71.93,22.86 70.94,21.87 55.63,21.87 54.63,22.86 DISP3.I 54.56,22.86 53.57,21.87 47.93,21.87 46.94,22.86 DISP2.I
OUT_2
  Top 0.152: R12.2 63.17,19.66 63.02,19.66 62.03,18.67 56.24,18.67 54.63,20.27 DISP3.H
  Bottom 0.152: DISP1.H 12.95,20.27 26.21,20.27 27.13,19.36 32.84,19.36 33.76,20.27 DISP2.H 33.83,20.34 47.02,20.34 47.93,21.26 53.65,21.26 54.56,20.34 DISP3.H 55.55,21.26 70.94,21.26 71.86,20.34 75.44,20.34 DISP4.H
OUT_3  (via drill 0.35)
  Top 0.152: DISP1.F 12.95,17.83 26.21,17.83 27.13,18.75 32.84,18.75 33.76,17.83 DISP2.F | v65.15,17.14 R13.2
  Bottom 0.152: DISP4.F 75.44,17.75 71.86,17.75 70.94,16.84 65.46,16.84 v65.15,17.14 55.24,17.14 DISP3.F 54.56,17.75 53.65,16.84 47.93,16.84 45.26,19.51 37.11,19.51 35.43,17.83 33.83,17.83 DISP2.F
OUT_4
  Top 0.152: DISP1.G1 26.14,15.24 27.13,16.23 32.77,16.23 33.76,15.24 DISP2.G1 | R14.2 63.17,15.39 62.18,16.38 62.18,17.98 62.03,18.14 57.53,18.14 54.63,15.24 DISP3.G1
  Bottom 0.152: DISP4.G1 71.93,15.24 70.94,16.23 55.63,16.23 54.63,15.24 DISP3.G1 54.56,15.24 53.57,16.23 47.93,16.23 46.94,15.24 DISP2.G1
OUT_5
  Top 0.152: DISP2.L 32.84,13.64 27.05,13.64 26.14,12.72 12.95,12.72 DISP1.L | DISP3.L 54.63,12.65 55.63,11.66 62.03,11.66 63.02,12.65 63.17,12.65 R16.2 63.25,12.65 64.16,11.73 70.94,11.73 71.86,12.65 75.44,12.65 DISP4.L
  Bottom 0.152: DISP2.L 33.83,12.72 47.02,12.72 47.93,13.64 53.65,13.64 54.56,12.72 DISP3.L
OUT_6
  Top 0.152: DISP1.K 12.95,10.21 26.21,10.21 27.13,11.12 32.84,11.12 33.76,10.21 DISP2.K | DISP3.K 54.63,10.21 55.63,11.2 62.03,11.2 63.02,10.21 63.17,10.21 R15.2 63.25,10.21 64.16,11.12 70.94,11.12 71.86,10.21 75.44,10.21 DISP4.K
  Bottom 0.152: DISP3.K 53.65,11.12 42.29,11.12 41.38,10.21 33.83,10.21 DISP2.K
OUT_7
  Top 0.152: DISP1.E 26.14,7.62 27.13,8.61 32.77,8.61 33.76,7.62 DISP2.E | DISP3.E 54.63,7.62 55.63,6.63 62.03,6.63 63.02,7.62 R17.2 63.25,7.62 64.24,8.61 70.94,8.61 71.93,7.62 DISP4.E
  Bottom 0.152: DISP2.E 46.94,7.62 47.93,8.61 53.57,8.61 54.56,7.62 DISP3.E
OUT_8
  Top 0.152: 75.44,5.11 69.88,5.11 DISP3.D2 69.8,5.11 54.63,5.11 DISP3.D1 54.56,5.11 49.07,5.11 DISP2.D2 47.17,6.93 42.29,6.93 R41.2 42.22,7.01 42.06,7.01 41.07,8 36.73,8 33.83,5.11 DISP2.D1 33.76,5.11 28.19,5.11 | 75.44,5.11 90.68,5.11 DISP4.D2 | 75.44,5.11 DISP4.D1 | 28.19,5.11 12.95,5.11 DISP1.D1 | 28.19,5.11 DISP1.D2
OUT_9
  Top 0.152: DISP2.C 49,12.65 45.87,9.53 R1.2 42.22,9.53 41.22,10.52 40.08,10.52 39.47,11.12 33.3,11.12 31.77,12.65 28.19,12.65 DISP1.C
  Bottom 0.152: DISP4.C 90.68,12.65 89.76,11.73 74.37,11.73 73.46,12.65 69.88,12.65 DISP3.C 69.8,12.72 66.14,12.72 65.46,13.41 57.38,13.41 55.7,11.73 49.99,11.73 DISP2.C
OUT_10
  Top 0.152: DISP2.M 49,15.24 45.87,12.12 42.29,12.12 R2.2 42.22,12.12 41.22,13.11 40.08,13.11 39.55,13.64 33.3,13.64 31.7,15.24 DISP1.M
  Bottom 0.152: DISP2.M 49.07,15.24 50.06,14.25 55.7,14.25 56.69,15.24 DISP3.M 69.88,15.24 70.87,14.25 76.5,14.25 77.5,15.24 DISP4.M
OUT_11
  Top 0.152: DISP2.G2 45.87,14.63 42.29,14.63 R3.2 42.22,14.63 41.22,15.62 40.08,15.62 39.47,16.23 33.3,16.23 31.77,17.75 28.19,17.75 DISP1.G2
  Bottom 0.152: DISP2.G2 49.99,18.75 55.7,18.75 56.62,17.83 69.8,17.83 DISP3.G2 69.88,17.83 70.79,18.75 76.5,18.75 77.42,17.83 90.68,17.83 DISP4.G2
OUT_12
  Top 0.152: DISP2.B 49,20.27 45.87,17.14 R6.2 42.22,17.14 41.22,18.14 40.08,18.14 39.47,18.75 33.3,18.75 31.77,20.27 28.19,20.27 DISP1.B
  Bottom 0.152: DISP2.B 49.99,19.36 55.7,19.36 56.62,20.27 69.8,20.27 DISP3.B 69.88,20.27 70.79,19.36 76.5,19.36 77.42,20.27 90.68,20.27 DISP4.B
OUT_13
  Top 0.152: 39.4,21.87 39.4,23.09 39.55,23.24 48.62,23.24 49,22.86 DISP2.J | 39.4,21.87 39.4,21.41 39.62,21.18 40.62,21.18 42.06,19.74 42.22,19.74 R7.2 | DISP1.J 31.7,22.86 32.69,21.87 39.4,21.87
  Bottom 0.152: DISP2.J 49.07,22.86 50.06,23.85 55.7,23.85 56.69,22.86 DISP3.J 69.88,22.86 70.87,23.85 76.5,23.85 77.5,22.86 DISP4.J
OUT_14  (via drill 0.35)
  Top 0.152: v44.73,18.9 46.71,20.88 46.71,21.49 46.02,22.17 42.29,22.17 R8.2
  Bottom 0.152: v44.73,18.9 36.96,18.9 34.29,16.23 32.69,16.23 29.87,13.41 29.87,11.89 29.83,11.85 | 29.83,11.85 28.19,10.21 DISP1.DP | 29.83,11.85 32.46,9.22 40.84,9.22 41.76,10.13 49,10.13 DISP2.DP 49.07,10.13 49.99,9.22 62.03,9.22 62.94,10.13 69.8,10.13 DISP3.DP 69.88,10.21 70.79,11.12 76.5,11.12 77.42,10.21 90.68,10.21 DISP4.DP
RST
  Top 0.152: REG.15 73.08,76.2 71.48,77.8 11.58,77.8 2.36,68.58 2.36,47.7 3.66,46.41 U$1.P7
VCC  (via drill 0.35)
  Top 0.508: OUTL.20 45.72,63.48 43.13,63.48 41.91,62.26 U$3.P+ | U$6.P+ 10.21,47.02 12.57,47.02 15.01,49.45 EEPROM0.28 EEPROM0.27 17.98,49.68 19.58,51.28 20.5,51.28 23.93,54.71 23.93,56.62 v27.66,60.35 27.74,60.58 27.74,61.11 29.41,62.79 29.41,64.62 v30.63,65.84 | IC4.16 76.2,63.48 73.61,63.48 72.39,62.26 U$2.P+ | CNT.10 CNT.9 63.7,76.05 66.14,76.05 67.13,75.06 U$8.P+ 68.58,76.2 REG.16 | 13.64,76.2 11.43,76.2 C8.+ | 13.64,76.2 R4.2 | U$1.P0 3.73,64.08 3.73,61.65 U$1.P1 3.96,61.65 6.25,61.65 U$1.P38 6.33,61.87 6.33,64.08 U$1.P39 | 13.64,63.48 11.43,63.48 10.21,62.26 U$5.P+ | 13.64,63.48 15.24,63.48 OUTH.20 | 13.64,63.48 13.64,76.2 | EEPROM1.27 EEPROM1.28 | IC5.4 38.1,71.09 40.65,73.65 | 40.65,73.65 41.91,74.91 U$7.P+ | 40.65,73.65 CNT.1
  Bottom 0.508: v27.66,60.35 38.94,60.35 40.77,62.18 41.91,62.18 U$3.P+ | U$2.P+ 72.39,65.08 68.66,68.81 | 68.66,68.81 68.58,68.89 68.58,73.69 67.36,74.91 U$8.P+ | U$1.P38 6.33,61.65 9.6,61.65 10.13,62.18 U$5.P+ | EEPROM1.28 58.45,47.02 55.93,47.02 U$4.P+ | CNT.1 47.47,70.33 58.9,70.33 60.66,68.58 CNT.7 61.04,68.35 62.03,67.36 62.03,62.79 63.55,61.27 | CNT.16 43.28,76.2 42.14,75.06 U$7.P+ 41.91,74.98 32.69,74.98 31.47,76.2 IC5.8 30.25,76.28 29.26,77.27 17.91,77.27 16.84,76.2 R4.2 | 63.55,61.27 64.62,60.2 64.62,54.79 63.55,53.72 63.55,49.53 EEPROM1.27 | 68.66,68.81 64.62,64.77 64.62,62.33 63.55,61.27 | v30.63,65.84 32.69,65.84 34.37,67.51 37.03,67.51 IC5.4